# Altium project ImperiumV2.PrjPcb
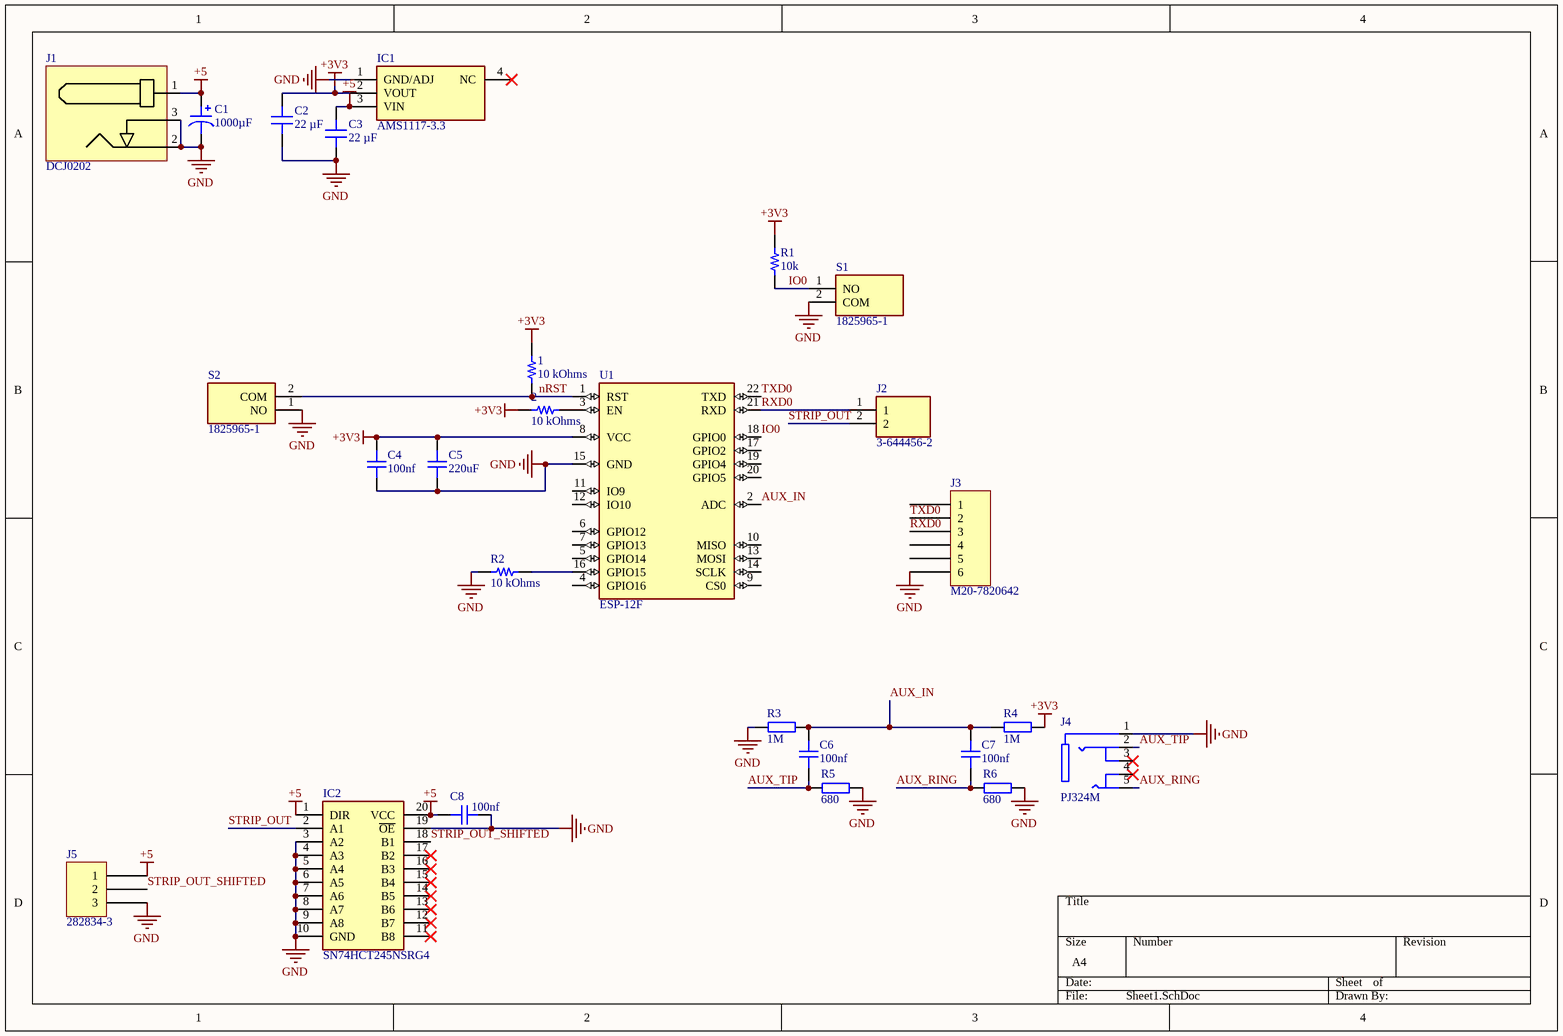
[diagram p0: Sheet1.SchDoc]
1 sheet, 26 parts. Net scope: global (net labels, ports and power ports of the same name join across sheets).
Board file: PCB1.PcbDoc

## Sheet Sheet1.SchDoc
size A4; SheetNumber: 1; SheetTotal: 1

### Parts
1  10 kOhms  [RES 0805_2012]
2  10 kOhms  [RES 0805_2012]
C1  1000µF  [CAP TH ALUM ELEC D8.00mm S3.50mm H17.50mm]
C2  22 µF  [CAP 0805_2012]
C3  22 µF  [CAP 0805_2012]
C4  100nf  [CAP_0805]
C5  220uF  [CAP_0805]
C6  100nf  [CAP_0805]
C7  100nf  [CAP_0805]
C8  100nf  [CAP_0805]
IC1  AMS1117-3.3  [SOT229P700X180-4N]
IC2  SN74HCT245NSRG4  [SOIC127P780X200-20N]
J1  DCJ0202  [DCJ0202]
J2  3-644456-2  [TE_3-644456-2]
J3  M20-7820642  [HARWIN M20-7820645]
J4  PJ324M  [WENZHOU_PJ324M]
J5  282834-3  [TE 282834-3]
R1  10k  [RES 0805_2012]
R2  10 kOhms  [RES 0805_2012]
R3  1M  [RES_0805]
R4  1M  [RES_0805]
R5  680  [RES_0805]
R6  680  [RES_0805]
S1  1825965-1  [18259651]
S2  1825965-1  [18259651]
U1  ESP-12F  [ESP-12F]

### Nets
+3V3: 1.1 2.1 C2.2 C4.1 C5.1 IC1.2(VOUT) R1.2 R4.1 U1.8(VCC)
+5: C1.1 C3.2 C8.2 IC1.3(VIN) IC2.1(DIR) IC2.20(VCC) J1.1 J5.1
GND: C1.2 C2.1 C3.1 C4.2 C5.2 C8.1 IC1.1(GND/ADJ) IC2.3(A2) IC2.4(A3) IC2.5(A4) IC2.6(A5) IC2.7(A6) IC2.8(A7) IC2.9(A8) IC2.10(GND) IC2.19(~{OE}) J1.2 J1.3 J3.6 J4.1(SLEEVE) J5.3 R2.1 R3.2 R5.2 R6.1 S1.2(COM) S2.1(NO) U1.15(GND)
AUX_IN: C6.2 C7.2 R3.1 R4.2 U1.2(ADC)
AUX_RING: C7.1 J4.5(TIP_2) R6.2
AUX_TIP: C6.1 J4.2(RING_1) R5.1
IO0: R1.1 S1.1(NO) U1.18(GPIO0)
nRST: 1.2 S2.2(COM) U1.1(RST)
RXD0: J2.1 J3.3 U1.21(RXD)
STRIP_OUT: IC2.2(A1) J2.2
STRIP_OUT_SHIFTED: IC2.18(B1) J5.2
TXD0: J3.2 U1.22(TXD)
Net2_2: 2.2 U1.3(EN)
NetR2_2: R2.2 U1.16(GPIO15)

Not connected (* = marked no-connect by the designer): IC1 4(NC)*; IC2 11(B8)* 12(B7)* 13(B6)* 14(B5)* 15(B4)* 16(B3)* 17(B2)*; J3 1 4 5; J4 3(RING_2)* 4(TIP_1)*; U1 4(GPIO16) 5(GPIO14) 6(GPIO12) 7(GPIO13) 9(CS0) 10(MISO) 11(IO9) 12(IO10) 13(MOSI) 14(SCLK) 17(GPIO2) 19(GPIO4) 20(GPIO5)

### Library data of the parts
1 2 R2 = 9-2176375-1: RES 10K OHM 0.1% 1/5W 0805; Manufacturer: TE Connectivity Passive Product; Power (Watts): 0.2W, 1/5W; Temperature Coefficient: ±10ppm/°C; Part Number: 9-2176375-1; Value: 10 kOhms; ComponentLink1Description: Datasheet; ComponentLink1URL: https://www.te.com/usa-en/product-9-2176375-1.datasheet.pdf; ComponentLink2Description: DigiKey Link; ComponentLink2URL: https://www.digikey.com/en/products/detail/te-connectivity-passive-product/9-2176375-1/18110542; Composition: Thin Film; Device Package: 0805 (2012 Metric); Features: Anti-Sulfur, Automotive AEC-Q200, Moisture Resistant; Height - Seated (Max): 0.026" (0.65mm); LastUpdated: 09/10/2023 7:52:15 pm; Lifecycle Status: Active; Minimum Order: 1; Number of Terminations: 2; Operating Temperature: -55°C ~ 155°C; Package / Case: 0805 (2012 Metric); Packaging: TapeAndReel; PartId: 76290; Part Status: Active; Price: 0.39; Ratings: AEC-Q200; Resistance: 10 kOhms; Series: RQ73; Size / Dimension: 0.079" L x 0.049" W (2.00mm x 1.25mm); Supplier 1: DigiKey; Supplier Part Number 1: 1712-9-2176375-1CT-ND; Supplier Device Package: 0805; Tolerance: ±0.1%
C1 = 6.3YXG1000MEFC8X16: CAP ALUM 1000UF 20% 6.3V RADIAL; manufacturer: Rubycon; Impedance: 87 mOhms; Lifetime @ Temp.: 4000 Hrs @ 105°C; Polarization: Polar; Ripple Current @ High Frequency: 840mA @ 100kHz; Ripple Current @ Low Frequency: 504mA @ 120Hz; Part Number: 6.3YXG1000MEFC8X16; Applications: General Purpose; Capacitance: 1000µF; componentlink1description: Datasheet; componentlink1url: http://www.rubycon.co.jp/en/catalog/e_pdfs/aluminum/e_yxg.pdf; componentlink2description: DigiKey Link; componentlink2url: http://digikey.com/product-detail/en/rubycon/6.3YXG1000MEFC8X16/1189-2348-ND/3563403; Device Package: Radial, Can; Height - Seated (Max): 0.689" (17.50mm); lastupdated: 08/09/2020 2:47:34 am; Lead Spacing: 0.138" (3.50mm); Lifecycle Status: Active; Minimum Order: 1; Mounting Type: Through Hole; Operating Temperature: -40°C ~ 105°C; Package / Case: Radial, Can; packaging: Bulk; partid: 24587; Part Status: Active; price: 0.51; series: YXG; Size / Dimension: 0.315" Dia (8.00mm); Supplier 1: DigiKey; Supplier Part Number 1: 1189-2348-ND; Tolerance: ±20%; value: 1000µF; Voltage - Rated: 6.3V
C2 C3 = 0805X226M6R3CT: CAP CER 22UF 6.3V X5R 0805; manufacturer: Walsin Technology Corporation; Tolerance: ±20%; Part Number: 0805X226M6R3CT; Value: 22 µF; Applications: General Purpose; Capacitance: 22 µF; componentlink1description: Datasheet; componentlink1url: https://www.passivecomponent.com/wp-content/uploads/datasheet/WTC_MLCC_General_Purpose.pdf; componentlink2description: DigiKey Link; componentlink2url: https://www.digikey.com/en/products/detail/walsin-technology-corporation/0805X226M6R3CT/6707560; Device Package: 0805 (2012 Metric); lastupdated: 09/10/2023 7:11:48 pm; Lifecycle Status: Active; Minimum Order: 1; Mounting Type: Surface Mount, MLCC; Operating Temperature: -55°C ~ 85°C; Package / Case: 0805 (2012 Metric); packaging: TapeAndReel; partid: 39842; Part Status: Active; price: 0.02; series: -; Size / Dimension: 0.079" L x 0.049" W (2.00mm x 1.25mm); Supplier 1: DigiKey; Supplier Part Number 1: 1292-0805X226M6R3CT-ND; Temperature Coefficient: X5R; Thickness (Max): 0.057" (1.45mm); Voltage - Rated: 6.3V
C4-C8 = CAP_0805_6V3: Capacitor SMD 0805 6V3
IC1 = AMS1117-3.3: Integrated Circuit; Manufacturer_Name: Advanced; Datasheet Link: https://datasheet.datasheetarchive.com/originals/distributors/Datasheets-28/DSA-550594.pdf; Height: 1.8mm; Manufacturer_Part_Number: AMS1117-3.3
IC2 = SN74HCT245NSRG4: Integrated Circuit; Manufacturer_Name: Texas Instruments; Datasheet Link: https://www.ti.com/lit/ds/symlink/sn74hct245.pdf?HQS=dis-mous-null-mousermode-dsf-pf-null-wwe&ts=1618816642034&ref_url=https%253A%252F%252Feu.mouser.com%252F; Height: 2mm; Manufacturer_Part_Number: SN74HCT245NSRG4; Mouser Part Number: 595-SN74HCT245NSRG4; Mouser Price/Stock: https://www.mouser.com/Search/Refine.aspx?Keyword=595-SN74HCT245NSRG4
J1 = DCJ0202: DC Barrell Jack 2.1mm 24V 5A THT; Manufacturer: CONEC; Manufacturer Part Number: DCJ0202
J2 = 3-644456-2: MF: {'manufacturer': u'TE Connectivity'}; Package: None; Price: None; Value: *; MP: 3-644456-2; Availability: Unavailable
J3 = M20-7820642: CONN RCPT 6POS 0.1 GOLD PCB; Manufacturer: Harwin Inc.; Connector Type: Receptacle; Contact Length - Post: 0.118" (3.00mm); Current Rating (Amps): 3A; Mated Stacking Heights: 11.04mm, 12.63mm; Material Flammability Rating: UL94 V-0; Number of Positions: 6; Number of Positions Loaded: All; Pitch - Mating: 0.100" (2.54mm); Style: Board to Board or Cable; Part Number: M20-7820642; ComponentLink1Description: Datasheet; ComponentLink1URL: https://cdn.harwin.com/pdfs/C001XX_M20_Series_Connectors.pdf; ComponentLink2Description: DigiKey Link; ComponentLink2URL: https://www.digikey.com/en/products/detail/harwin-inc/M20-7820642/3727776; Contact Finish - Mating: Gold; Contact Finish - Post: Tin; Contact Finish Thickness - Mating: Flash; Contact Type: Female Socket; Fastening Type: Push-Pull; Insulation Color: Black; Insulation Height: 0.335" (8.51mm); LastUpdated: 21/09/2022 6:58:09 pm; Lifecycle Status: Active; Minimum Order: 1; Mounting Type: Through Hole; Number of Rows: 1; Operating Temperature: -40°C ~ 105°C; Packaging: Tube; Part Status: Active; Price: 0.55; Series: M20; Supplier 1: DigiKey; Supplier Part Number 1: 952-1808-ND; Termination: Solder
J4 = PJ324M: Headphone Stereo jack/Audio connector; MF: Wenzhou QingPu Electronics Co.Ltd; MP: PJ324M; Value: *; Check_prices: https://www.snapeda.com/parts/PJ324M/Wenzhou%20QingPu%20Electronics%20Co.Ltd/view-part/3664803/?ref=eda; SnapEDA_Link: https://www.snapeda.com/parts/PJ324M/Wenzhou%20QingPu%20Electronics%20Co.Ltd/view-part/3664803/?ref=snap; Price: None; Availability: Not in stock; Package: Package
J5 = 282834-3: TERM BLK 3P SIDE ENT 2.54MM PCB; Manufacturer: TE Connectivity AMP Connectors; Current: 10A; Mating Orientation: Horizontal with Board; Number of Levels: 1; Pitch: 0.100" (2.54mm); Positions Per Level: 3; Voltage: 150V; Wire Gauge: 16-30 AWG; Wire Termination: Screw - Rising Cage Clamp; Part Number: 282834-3; Color: Green; ComponentLink1Description: Datasheet; ComponentLink1URL: https://www.te.com/commerce/DocumentDelivery/DDEController?Action=srchrtrv&DocNm=282834&DocType=Customer+Drawing&DocLang=English; ComponentLink2Description: DigiKey Link; ComponentLink2URL: http://digikey.com/product-detail/en/te-connectivity-amp-connectors/282834-3/A98334-ND/1153264; LastUpdated: 15/01/2020 4:15:50 am; Lifecycle Status: Active; Minimum Order: 1; Mounting Type: Through Hole; Packaging: Bulk; Part Status: Active; Price: 2.01; Series: Buchanan; Supplier 1: DigiKey; Supplier Part Number 1: A98334-ND
R1 = 9-2176375-1: RES 10K OHM 0.1% 1/5W 0805; Manufacturer: TE Connectivity Passive Product; Power (Watts): 0.2W, 1/5W; Resistance: 10 kOhms; Temperature Coefficient: ±10ppm/°C; Part Number: 9-2176375-1; Value: 10k; ComponentLink1Description: Datasheet; ComponentLink1URL: https://www.te.com/usa-en/product-9-2176375-1.datasheet.pdf; ComponentLink2Description: DigiKey Link; ComponentLink2URL: https://www.digikey.com/en/products/detail/te-connectivity-passive-product/9-2176375-1/18110542; Composition: Thin Film; Device Package: 0805 (2012 Metric); Features: Anti-Sulfur, Automotive AEC-Q200, Moisture Resistant; Height - Seated (Max): 0.026" (0.65mm); LastUpdated: 09/10/2023 7:52:15 pm; Lifecycle Status: Active; Minimum Order: 1; Number of Terminations: 2; Operating Temperature: -55°C ~ 155°C; Package / Case: 0805 (2012 Metric); Packaging: TapeAndReel; PartId: 76290; Part Status: Active; Price: 0.39; Ratings: AEC-Q200; Series: RQ73; Size / Dimension: 0.079" L x 0.049" W (2.00mm x 1.25mm); Supplier 1: DigiKey; Supplier Part Number 1: 1712-9-2176375-1CT-ND; Supplier Device Package: 0805; Tolerance: ±0.1%
R3-R6 = RES_0805: Resistor SMD 0805; Manufacturer: *; Manufacturer Part Number: *; Distributor Link: *
S1 S2 = 1825965-1: Switch; Manufacturer_Name: TE Connectivity; Datasheet Link: https://www.arrow.com/en/products/1825965-1/te-connectivity; Height: 5mm; Manufacturer_Part_Number: 1825965-1; Arrow Part Number: 1825965-1; Arrow Price/Stock: https://www.arrow.com/en/products/1825965-1/te-connectivity?region=nac
U1 = ESP-12F: WiFi Module; MF: AI-Thinker; Price: None; SnapEDA_Link: https://www.snapeda.com/parts/ESP-12F/AI-Thinker/view-part/6648243/?ref=snap; Check_prices: https://www.snapeda.com/parts/ESP-12F/AI-Thinker/view-part/6648243/?ref=eda; Availability: No availability data; Value: *; MP: ESP-12F; Package: Package